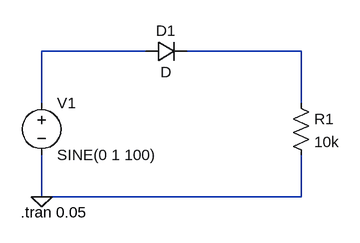
[diagram p0: schematic half-wave.asc]
half-wave.asc, the LTspice schematic file:
Version 4
SHEET 1 880 680
WIRE 176 64 16 64
WIRE 416 64 240 64
WIRE 16 144 16 64
WIRE 416 144 416 64
WIRE 16 288 16 224
WIRE 416 288 416 224
WIRE 416 288 16 288
FLAG 16 288 0
SYMBOL voltage 16 128 R0
WINDOW 123 0 0 Left 0
WINDOW 39 0 0 Left 0
SYMATTR InstName V1
SYMATTR Value SINE(0 1 100)
SYMBOL diode 176 80 R270
WINDOW 0 32 32 VTop 2
WINDOW 3 0 32 VBottom 2
SYMATTR InstName D1
SYMBOL res 400 128 R0
SYMATTR InstName R1
SYMATTR Value 10k
TEXT -16 312 Left 2 !.tran 0.05

The netlist it stands for:
* half-wave.asc
V1 N001 0 SINE(0 1 100)
D1 N001 N002 D
R1 N002 0 10k
.model D D
.lib standard.dio
.tran 0.05
.backanno
.end